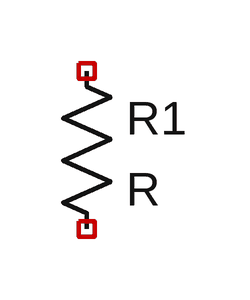
[diagram p0: schematic 2nd_Stage_Gain.asc]
2nd_Stage_Gain.asc, the LTspice schematic file:
Version 4
SHEET 1 880 680
SYMBOL res 144 80 R0
SYMATTR InstName R1

The netlist it stands for:
* 2nd_Stage_Gain.asc
R1 NC_01 NC_02 R
.backanno
.end